# EAGLE schematic Stepper5_bakcup (EAGLE 7.6.0)
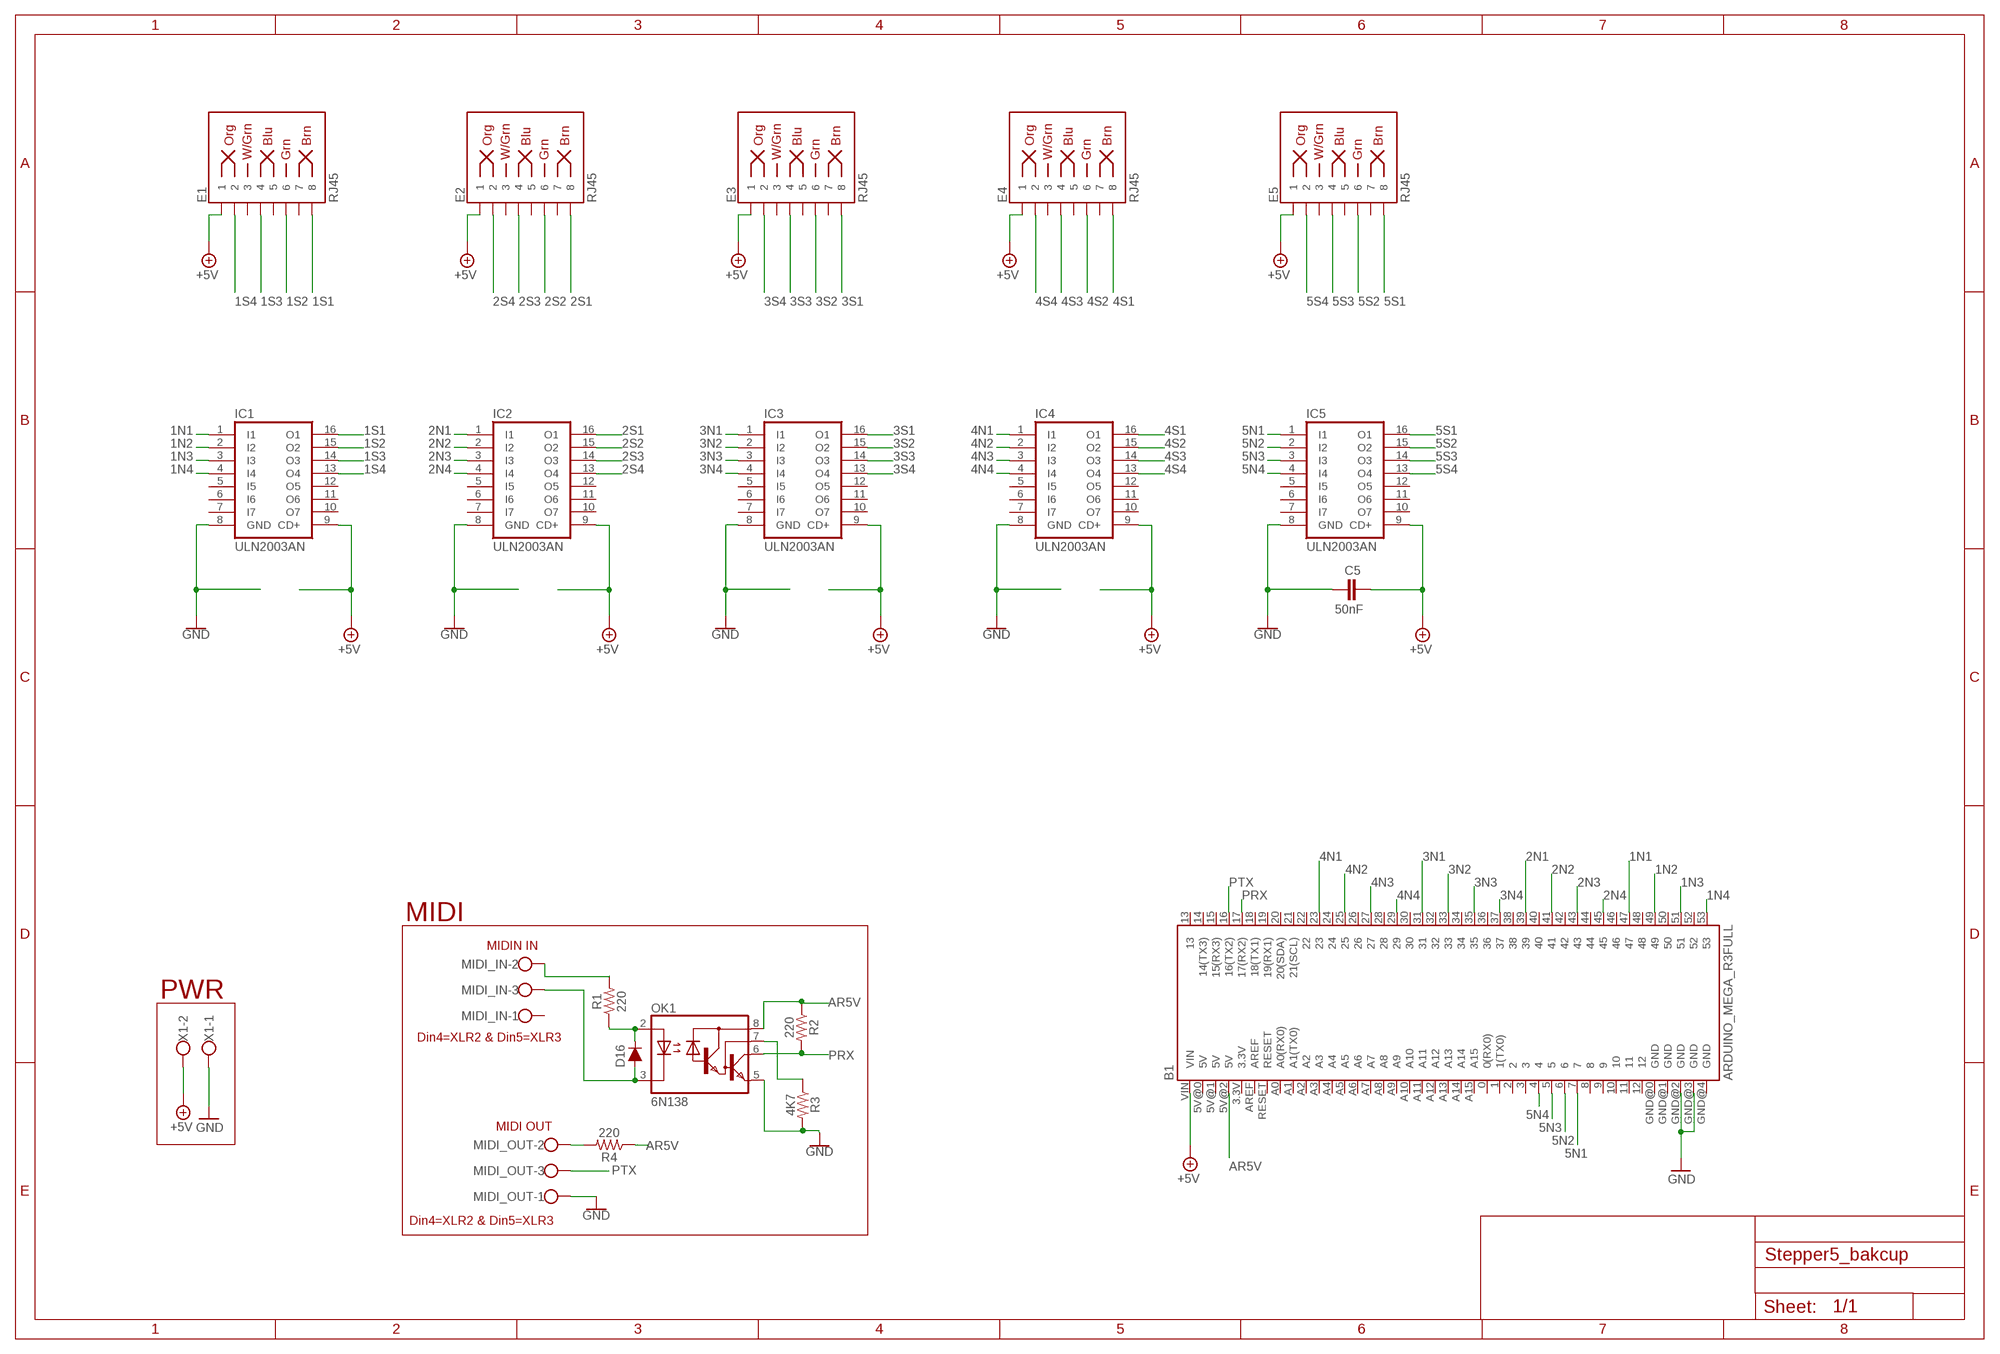
[diagram p0: schematic, sheet 1]

## Parts
B1  ARDUINO_MEGA_R3FULL  [ARDUINO_MEGA]
C5  50nF  C5/2.5  [C5B2.5]
D16  200mA/100V/1V  DIODE-1N4148  [DIODE-1N4148]
E1  RJ45  RJ45-8  [RJ45-8]
E2  RJ45  RJ45-8  [RJ45-8]
E3  RJ45  RJ45-8  [RJ45-8]
E4  RJ45  RJ45-8  [RJ45-8]
E5  RJ45  RJ45-8  [RJ45-8]
IC1  ULN2003AN  [DIL16]
IC2  ULN2003AN  [DIL16]
IC3  ULN2003AN  [DIL16]
IC4  ULN2003AN  [DIL16]
IC5  ULN2003AN  [DIL16]
MIDI_IN  W237-103  [W237-103]
MIDI_OUT  W237-103  [W237-103]
OK1  6N138  [DIL08]
R1  220  1KOHM-HORIZ-1/4W-5%  [AXIAL-0.3]
R2  220  1KOHM-HORIZ-1/4W-5%  [AXIAL-0.3]
R3  4K7  1KOHM-HORIZ-1/4W-5%  [AXIAL-0.3]
R4  220  1KOHM-HORIZ-1/4W-5%  [AXIAL-0.3]
X1  W237-102  [W237-102]

## Nets
1N1: B1.47 IC1.1(I1)
1N2: B1.49 IC1.2(I2)
1N3: B1.51 IC1.3(I3)
1N4: B1.53 IC1.4(I4)
1S1: E1.8 IC1.16(O1)
1S2: E1.6 IC1.15(O2)
1S3: E1.4 IC1.14(O3)
1S4: E1.2 IC1.13(O4)
2N1: B1.39 IC2.1(I1)
2N2: B1.41 IC2.2(I2)
2N3: B1.43 IC2.3(I3)
2N4: B1.45 IC2.4(I4)
2S1: E2.8 IC2.16(O1)
2S2: E2.6 IC2.15(O2)
2S3: E2.4 IC2.14(O3)
2S4: E2.2 IC2.13(O4)
3N1: B1.31 IC3.1(I1)
3N2: B1.33 IC3.2(I2)
3N3: B1.35 IC3.3(I3)
3N4: B1.37 IC3.4(I4)
3S1: E3.8 IC3.16(O1)
3S2: E3.6 IC3.15(O2)
3S3: E3.4 IC3.14(O3)
3S4: E3.2 IC3.13(O4)
4N1: B1.23 IC4.1(I1)
4N2: B1.25 IC4.2(I2)
4N3: B1.27 IC4.3(I3)
4N4: B1.29 IC4.4(I4)
4S1: E4.8 IC4.16(O1)
4S2: E4.6 IC4.15(O2)
4S3: E4.4 IC4.14(O3)
4S4: E4.2 IC4.13(O4)
5N1: B1.7 IC5.1(I1)
5N2: B1.6 IC5.2(I2)
5N3: B1.5 IC5.3(I3)
5N4: B1.4 IC5.4(I4)
5S1: E5.8 IC5.16(O1)
5S2: E5.6 IC5.15(O2)
5S3: E5.4 IC5.14(O3)
5S4: E5.2 IC5.13(O4)
+5V: B1.VIN C5.2 E1.1 E2.1 E3.1 E4.1 E5.1 IC1.9(CD+) IC2.9(CD+) IC3.9(CD+) IC4.9(CD+) IC5.9(CD+) X1.2
AR5V: B1.5V@2(5V) OK1.8(VCC) R2.P$1 R4.P$1
GND [GND]: B1.GND@2(GND) B1.GND@3(GND) C5.1 IC1.8(GND) IC2.8(GND) IC3.8(GND) IC4.8(GND) IC5.8(GND) MIDI_OUT.1 OK1.5(GND) R3.P$2 X1.1
N$2: MIDI_OUT.2 R4.P$2
N$25: D16.A MIDI_IN.3 OK1.3(C)
N$26: D16.C OK1.2(A) R1.P$1
N$27: MIDI_IN.2 R1.P$2
N$29: OK1.7(VB) R3.P$1
PRX: B1.17(17(RX2)) OK1.6(VO) R2.P$2
PTX: B1.16(16(TX2)) MIDI_OUT.3
Unconnected: B1.0(0(RX0)) B1.1(1(TX0)) B1.2 B1.3 B1.3.3V B1.5V@0(5V) B1.5V@1(5V) B1.8 B1.9 B1.10 B1.11 B1.12 B1.13 B1.14(14(TX3)) B1.15(15(RX3)) B1.18(18(TX1)) B1.19(19(RX1)) B1.20(20(SDA)) B1.21(21(SCL)) B1.22 B1.24 B1.26 B1.28 B1.30 B1.32 B1.34 B1.36 B1.38 B1.40 B1.42 B1.44 B1.46 B1.48 B1.50 B1.52 B1.A0(A0(RX0)) B1.A1(A1(TX0)) B1.A2 B1.A3 B1.A4 B1.A5 B1.A6 B1.A7 B1.A8 B1.A9 B1.A10 B1.A11 B1.A12 B1.A13 B1.A14 B1.A15 B1.AREF B1.GND@0(GND) B1.GND@1(GND) B1.GND@4(GND) B1.RESET E1.3 E1.5 E1.7 E2.3 E2.5 E2.7 E3.3 E3.5 E3.7 E4.3 E4.5 E4.7 E5.3 E5.5 E5.7 IC1.5(I5) IC1.6(I6) IC1.7(I7) IC1.10(O7) IC1.11(O6) IC1.12(O5) IC2.5(I5) IC2.6(I6) IC2.7(I7) IC2.10(O7) IC2.11(O6) IC2.12(O5) IC3.5(I5) IC3.6(I6) IC3.7(I7) IC3.10(O7) IC3.11(O6) IC3.12(O5) IC4.5(I5) IC4.6(I6) IC4.7(I7) IC4.10(O7) IC4.11(O6) IC4.12(O5) IC5.5(I5) IC5.6(I6) IC5.7(I7) IC5.10(O7) IC5.11(O6) IC5.12(O5) MIDI_IN.1

## Notes on the sheet
- MIDI
- MIDIN IN
- PWR
- Din4=XLR2 & Din5=XLR3
- MIDI OUT
- Din4=XLR2 & Din5=XLR3

## Library data of the parts
B1 = SparkFun-Boards:ARDUINO_MEGA_R3: Arduino Mega R3 ATmega2560 R3 compatible footprint. SparkFun Products: Arduino Mega 2560 R3 <https://www.sparkfun.com/products/11061>
C5 = capacitor-wima:C: CAPACITOR naming: grid - package width
D16 = SparkFun-DiscreteSemi:DIODE: Diode These are standard reverse protection diodes and small signal diodes. SparkFun Products: SparkFun SparkPunk Sound Kit <https://www.sparkfun.com/products/11177> SparkFun ESP8266 Thing <https://www.sparkfun.com/products/13231>; PROD_ID: DIO-08378
E1-E5 = SparkFun-Connectors:RJ45-8: RJ45 Jack - 8 pin Simple RJ45, 8-pin connection. Commonly used for Cat5, Cat5e, and Cat6 Ethernet cables. Here is the connector we sell at SparkFun: RJ45 8-Pin Connector <https://www.sparkfun.com/products/643> (PRT-00643) Datasheet <https://cdn.sparkfun.com/datasheets/Prototyping/04908.pdf> It is used on this SparkFun product: SparkFun RJ45 Breakout <https://www.sparkfun.com/products/716> (BOB-00716) Note, you may also be interested in the "MAGJACK" version of this. It is basically a RJ45 connector, but also has some status LEDs built into the connector housing. You can check that out in this library at the device named "MAGJACK.dev" and see these products online: RJ45 Ethernet MagJack-Compatible <https://www.sparkfun.com/products/8534> (PRT-08534) SparkFun RJ45 MagJack Breakout <https://www.sparkfun.com/products/13021> (BOB-13021); PROD_ID: CONN-08506; SF_ID: PRT-00643
IC1-IC5 = uln-udn:ULN2003A: DRIVER ARRAY
MIDI_IN MIDI_OUT = con-wago-500:W237-103: WAGO SCREW CLAMP; MPN: 237-103; OC_FARNELL: unknown; OC_NEWARK: 18M7116
OK1 = optocoupler:6N138: MOTOROLA OPTO COUPLER; MF: VISHAY/TELEFUNKEN; MPN: 6N138; OC_FARNELL: 9860150; OC_NEWARK: 35K5294
R1-R4 = SparkFun-Resistors:1KOHM: 1kΩ resistor A resistor is a passive two-terminal electrical component that implements electrical resistance as a circuit element. Resistors act to reduce current flow, and, at the same time, act to lower voltage levels within circuits. - Wikipedia; PROD_ID: RES-08380; VALUE: 1k
X1 = con-wago-500:W237-102: WAGO SCREW CLAMP; MPN: 237-102; OC_FARNELL: unknown; OC_NEWARK: 70K9898

## Net classes
1 GND: width 1.016 mm, drill 0.508 mm, clearance 0.508 mm